# EAGLE design goduino3-v0.22 (EAGLE 6.2)
Design: GOduino 3 Remixed by: Hazim Bitar (techbitar) Date: August 2012 URL: facebook.com/pin13
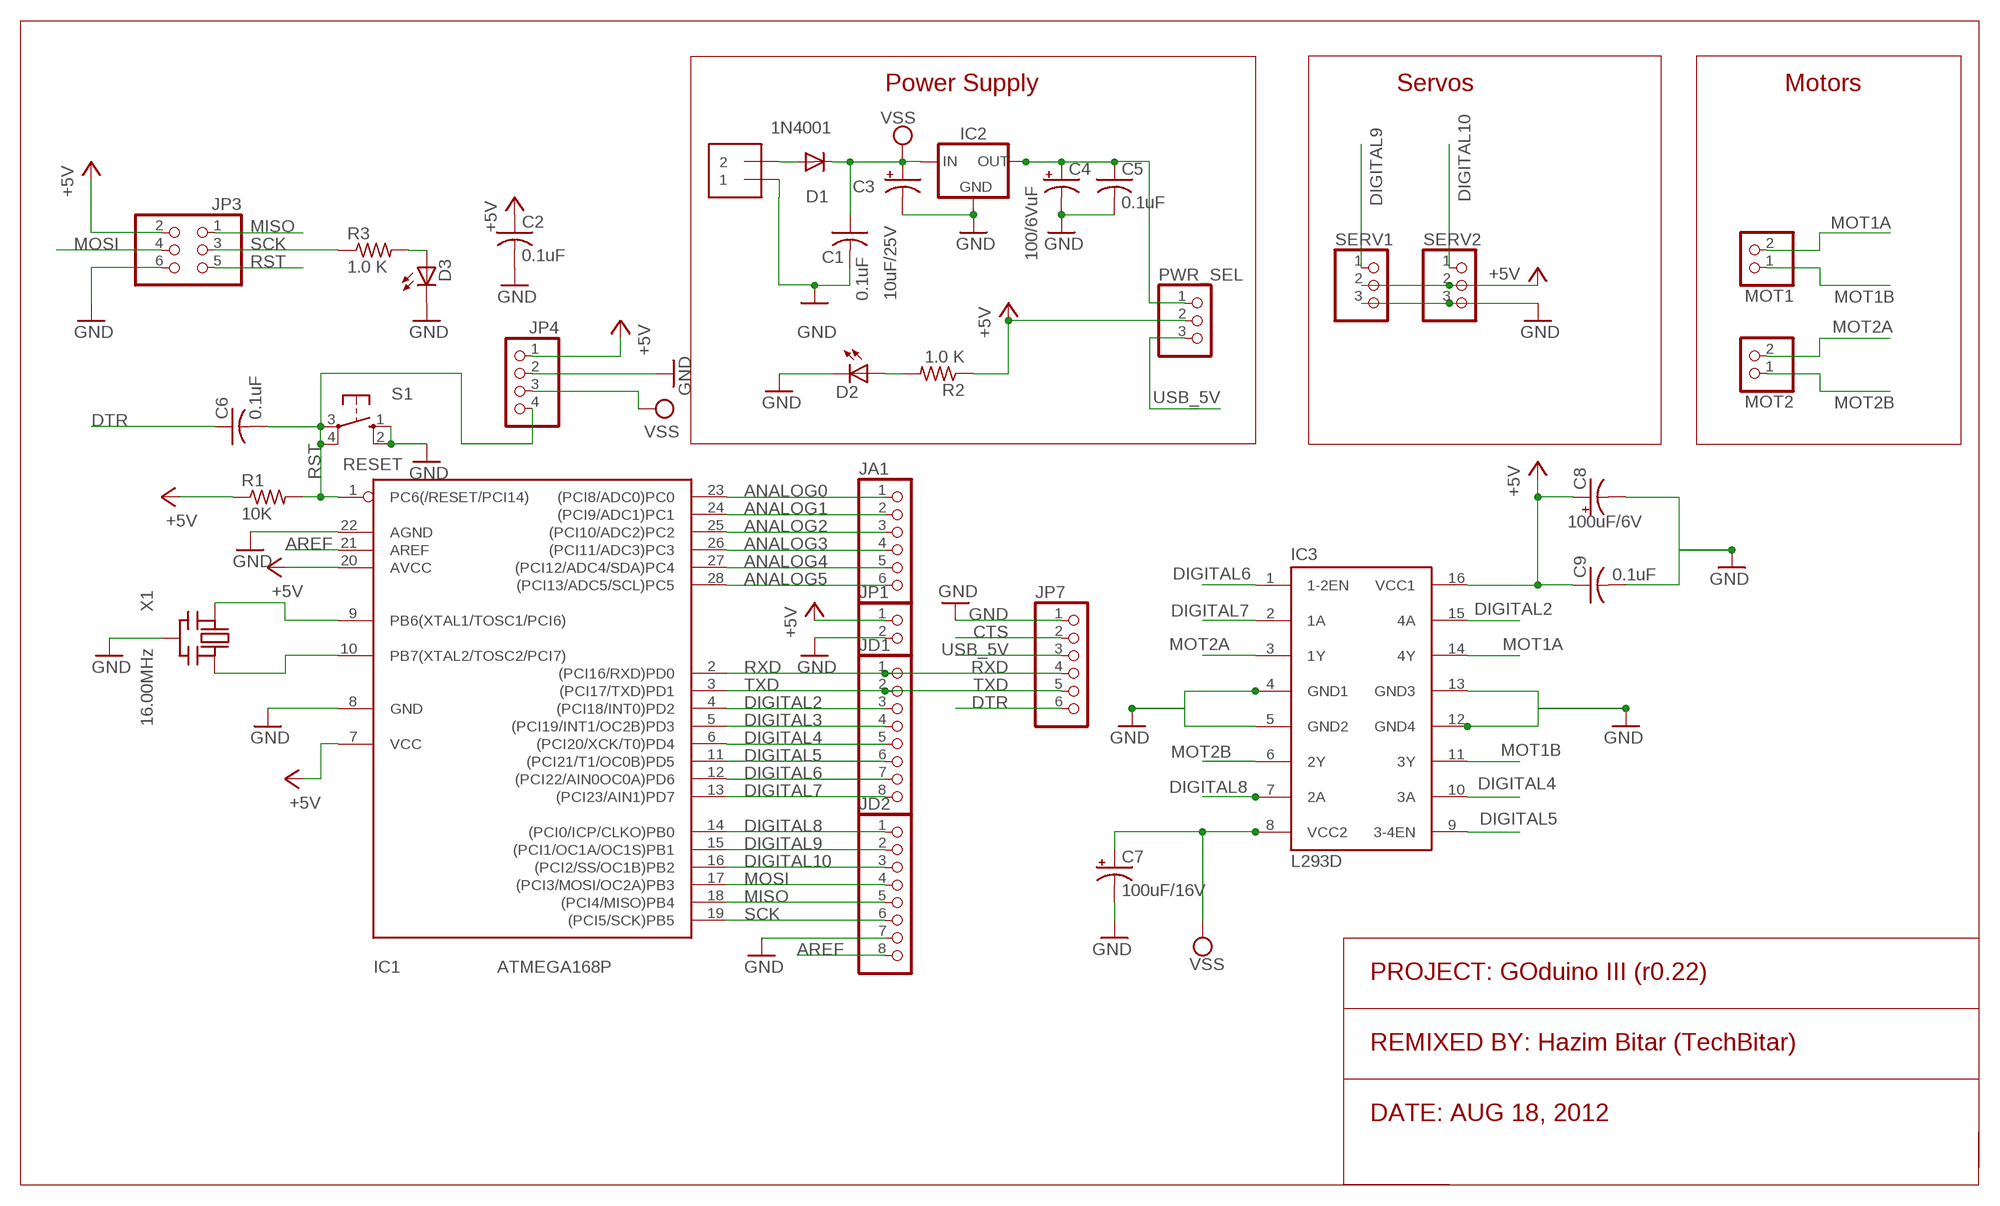
[diagram p0: schematic, sheet 1]

## Parts
C1  0.1uF  C-US025-025X050  [C025-025X050]
C2  0.1uF  C-US025-025X050  [C025-025X050]
C3  10uF/25V  CPOL-USE2.5-6  [E2,5-6]
C4  100/6VuF  CPOL-USE2.5-6  [E2,5-6]
C5  0.1uF  C-US025-025X050  [C025-025X050]
C6  0.1uF  C-US025-025X050  [C025-025X050]
C7  100uF/16V  CPOL-USE2.5-6  [E2,5-6]
C8  100uF/6V  CPOL-USE2.5-5  [E2,5-5]
C9  0.1uF  C-US025-025X050  [C025-025X050]
D1  1N4001  1N4004  [DO41-10]
D2  LED3MM  [LED3MM]
D3  Green  LED3MM  [LED3MM]
IC1  ATMEGA168P  ATMEGA168PROUND  [DIL28/3]
IC2  78XXS  [78XXS]
IC3  L293D  [DIL16]
J2  1X2-3.5MM  [1X2-3.5MM]
JA1  PINHD-1X6CB  [1X06-CLEANBIG]
JD1  PINHD-1X8CLEANBIG  [1X08-CLEANBIG]
JD2  PINHD-1X8CLEANBIG  [1X08-CLEANBIG]
JP1  PINHD-1X2CB  [1X02-CB]
JP3  PINHD-2X3  [2X03]
JP4  PINHD-1X4CB  [1X04-CB]
JP7  PINHD-1X6CLEAN  [1X06-CLEAN]
MOT1  PINHD-1X2CB  [1X02-CB]
MOT2  PINHD-1X2CB  [1X02-CB]
PWR_SEL  PINHD-1X3  [1X03]
R1  10K  R-US_0207/5V  [0207/5V]
R2  1.0 K  R-US_0207/5V  [0207/5V]
R3  1.0 K  R-US_0207/5V  [0207/5V]
S1  RESET  10-XX  [B3F-10XX]
SERV1  PINHD-1X3  [1X03]
SERV2  PINHD-1X3  [1X03]
X1  16.00MHz  CERMOSCILL  [CERM_OSC]

## Nets
+5V [power]: C2.1 C8.+ C9.1 IC1.7(VCC) IC1.20(AVCC) IC3.16(VCC1) JP1.1 JP3.2 JP4.1 PWR_SEL.2 R1.1 R2.1 SERV1.2 SERV2.2
ANALOG0: IC1.23((PCI8/ADC0)PC0) JA1.1
ANALOG1: IC1.24((PCI9/ADC1)PC1) JA1.2
ANALOG2: IC1.25((PCI10/ADC2)PC2) JA1.3
ANALOG3: IC1.26((PCI11/ADC3)PC3) JA1.4
ANALOG4: IC1.27((PCI12/ADC4/SDA)PC4) JA1.5
ANALOG5: IC1.28((PCI13/ADC5/SCL)PC5) JA1.6
AREF: IC1.21(AREF) JD2.8
CTS: JP7.2
DIGITAL2: IC1.4((PCI18/INT0)PD2) IC3.15(4A) JD1.3
DIGITAL3: IC1.5((PCI19/INT1/OC2B)PD3) JD1.4
DIGITAL4: IC1.6((PCI20/XCK/T0)PD4) IC3.10(3A) JD1.5
DIGITAL5: IC1.11((PCI21/T1/OC0B)PD5) IC3.9(3-4EN) JD1.6
DIGITAL6: IC1.12((PCI22/AIN0OC0A)PD6) IC3.1(1-2EN) JD1.7
DIGITAL7: IC1.13((PCI23/AIN1)PD7) IC3.2(1A) JD1.8
DIGITAL8: IC1.14((PCI0/ICP/CLKO)PB0) IC3.7(2A) JD2.1
DIGITAL9: IC1.15((PCI1/OC1A/OC1S)PB1) JD2.2 SERV1.1
DIGITAL10: IC1.16((PCI2/SS/OC1B)PB2) JD2.3 SERV2.1
DTR: C6.1 JP7.6
GND [GND]: C1.2 C2.2 C3.- C4.- C5.2 C7.- C8.- C9.2 D2.K(C) D3.K(C) IC1.8(GND) IC1.22(AGND) IC2.GND IC3.4(GND1) IC3.5(GND2) IC3.12(GND4) IC3.13(GND3) J2.1 JD2.7 JP1.2 JP3.6 JP4.2 JP7.1 S1.1(S) S1.2(S1) SERV1.3 SERV2.3 X1.P$2(GND)
MISO: IC1.18((PCI4/MISO)PB4) JD2.5 JP3.1
MOSI: IC1.17((PCI3/MOSI/OC2A)PB3) JD2.4 JP3.4
MOT1A [MOT]: IC3.14(4Y) MOT1.2
MOT1B [MOT]: IC3.11(3Y) MOT1.1
MOT2A [MOT]: IC3.3(1Y) MOT2.2
MOT2B [MOT]: IC3.6(2Y) MOT2.1
N$1: IC1.9(PB6(XTAL1/TOSC1/PCI6)) X1.P$1(IN)
N$2: IC1.10(PB7(XTAL2/TOSC2/PCI7)) X1.P$3(OUT)
N$3: D2.A R2.2
N$4: D3.A R3.2
N$22 [power]: C4.+ C5.1 IC2.OUT PWR_SEL.1
RST: C6.2 IC1.1(PC6(/RESET/PCI14)) JP3.5 JP4.4 R1.2 S1.3(P) S1.4(P1)
RXD: IC1.2((PCI16/RXD)PD0) JD1.1 JP7.4
SCK: IC1.19((PCI5/SCK)PB5) JD2.6 JP3.3 R3.1
TXD: IC1.3((PCI17/TXD)PD1) JD1.2 JP7.5
USB_5V [power]: JP7.3 PWR_SEL.3
VSS [power]: C1.1 C3.+ C7.+ D1.A D1.C IC2.IN IC3.8(VCC2) J2.2 JP4.3

## Notes on the sheet
- Power Supply | Servos | Motors
- PROJECT: GOduino III (r0.22)
- REMIXED BY: Hazim Bitar (TechBitar)
- DATE: AUG 18, 2012

## Library data of the parts
C1 C2 C5 C6 = minimidi:C-US: CAPACITOR, American symbol
C3 C4 = minimidi:CPOL-US: POLARIZED CAPACITOR, American symbol
C7 C8 = rcl:CPOL-US: POLARIZED CAPACITOR, American symbol
C9 = rcl:C-US: CAPACITOR, American symbol
D1 = minimidi:1N4004: DIODE general purpose rectifier, 1 A
D2 D3 = minimidi:LED: LED OSRAM: - CHIPLED LG R971, LG N971, LY N971, LG Q971, LY Q971, LO R971, LY R971 LH N974, LH R974 LS Q976, LO Q976, LY Q976 LO Q996 - Hyper CHIPLED LW Q18S LB Q993, LB Q99A, LB R99A - SideLED LS A670, LO A670, LY A670, LG A670, LP A670 LB A673, LV A673, LT A673, LW A673 LH A674 LY A675 LS A676, LA A676, LO A676, LY A676, LW A676 LS A679, LY A679, LG A679 - Hyper Micro SIDELED® LS Y876, LA Y876, LO Y876, LY Y876 LT Y87S - SmartLED LW L88C, LW L88S LB L89C, LB L89S, LG L890 LS L89K, LO L89K, LY L89K LS L896, LA L896, LO L896, LY L896 - TOPLED LS T670, LO T670, LY T670, LG T670, LP T670 LSG T670, LSP T670, LSY T670, LOP T670, LYG T670 LG T671, LOG T671, LSG T671 LB T673, LV T673, LT T673, LW T673 LH T674 LS T676, LA T676, LO T676, LY T676, LB T676, LH T676, LSB T676, LW T676 LB T67C, LV T67C, LT T67C, LS T67K, LO T67K, LY T67K, LW E67C LS E67B, LA E67B, LO E67B, LY E67B, LB E67C, LV E67C, LT E67C LW T67C LS T679, LY T679, LG T679 LS T770, LO T770, LY T770, LG T770, LP T770 LB T773, LV T773, LT T773, LW T773 LH T774 LS E675, LA E675, LY E675, LS T675 LS T776, LA T776, LO T776, LY T776, LB T776 LHGB T686 LT T68C, LB T68C - Hyper Mini TOPLED® LB M676 - Mini TOPLED Santana® LG M470 LS M47K, LO M47K, LY M47K Source: http://www.osram.convergy.de/
IC1 = avr:ATMEGA168*P: MICROCONTROLLER 16 kBytes FLASH 1 kBytes SRAM 512 Bytes EEPROM USART 8-channel 10 bit ADC
IC2 = v-reg:78XXS: VOLTAGE REGULATOR
IC3 = st-microelectronics:L293D: PUSH-PULL 4 CHANNEL DRIVER; MPN: L293D; OC_FARNELL: 9589619; OC_NEWARK: 56P8249
J2 = adafruit:1X2: 3.5mm Terminal block http://www.ladyada.net/library/pcb/eaglelibrary.html
JA1 JP7 = carduino:PINHD-1X6: PIN HEADER
JD1 JD2 = carduino:PINHD-1X8: PIN HEADER
JP1 MOT1 MOT2 = carduino:PINHD-1X2: PIN HEADER
JP3 = pinhead-ez:PINHD-2X3: PIN HEADER
JP4 = carduino:PINHD-1X4: PIN HEADER
PWR_SEL SERV1 SERV2 = pinhead:PINHD-1X3: PIN HEADER
R1 = rcl-ez:R-US_: RESISTOR, American symbol
R2 R3 = minimidi:R-US_: RESISTOR, American symbol
S1 = switch-omron:10-XX: OMRON SWITCH
X1 = digg:CERMOSCILL

## Net classes
0 default: width 0.305 mm
1 power: width 0.813 mm
2 GND: width 0.813 mm
3 MOT: width 0.813 mm

## Board
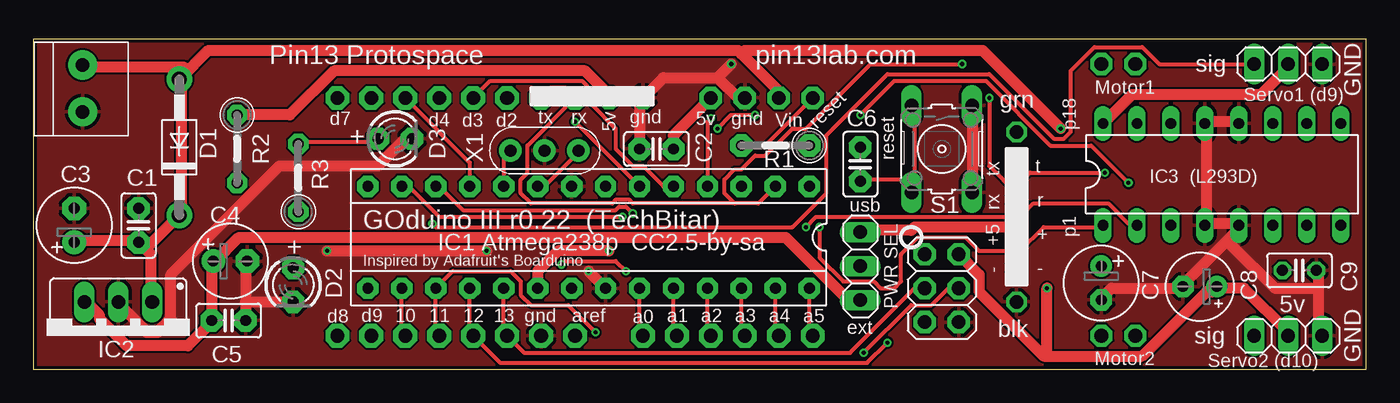
[diagram p1: board, top side]
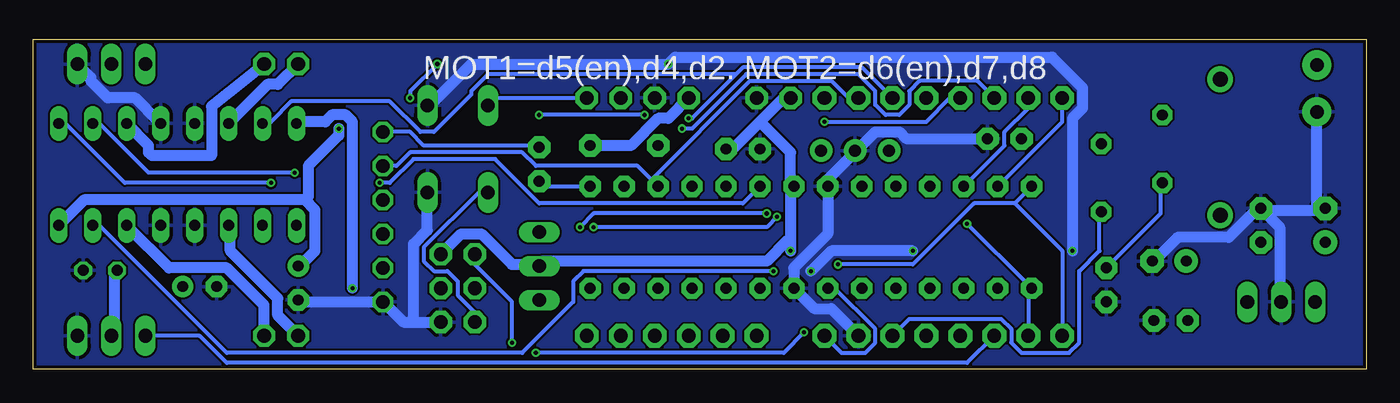
[diagram p2: board, bottom side, seen from below]

Size 99.67 x 24.69 mm. Coordinates in mm from the lower left corner, seen from the top.
Outline: 0,0 99.67,0 99.67,24.69 0,24.69 0,0
Copper layers (1*16): Top 0.035mm / dielectric 1.5mm / Bottom 0.035mm
Design rules: minimum track width 6mil, minimum drill 12mil, track to track 6mil, track to pad 6mil, pad to pad 6mil, via to via 6mil, smd to smd 0mil, copper to edge 10mil, drill to drill 10mil, minimum pad ring 10mil, minimum via ring 6mil, stop-mask expansion 2mil, vias tented up to drill 100mil, thermal gap 10mil

### Footprints (pad centres in the part's own frame; a part is rotated, then mirrored left to right if it is on the bottom)
C025-025X050 = drill 0.813 pad 1.676 octagon: 1 -1.27,0; 2 1.27,0
E2,5-6 = drill 0.813 pad 1.778: + -1.27,0 | drill 0.813 pad 1.778 octagon: - 1.27,0
E2,5-6' = drill 0.813 pad 1.6: + -1.27,0 | drill 0.813 pad 1.6 octagon: - 1.27,0
E2,5-5 = drill 0.813 pad 1.6: + -1.27,0 | drill 0.813 pad 1.6 octagon: - 1.27,0
C025-025X050' = drill 0.813 octagon: 1 -1.27,0; 2 1.27,0
DO41-10 = drill 1.118 pad 1.93: A 5.08,0; C -5.08,0
LED3MM = drill 0.813 pad 1.676 octagon: A -1.27,0; K 1.27,0
DIL28/3 = drill 0.813 pad 1.6 octagon: 1 -16.51,-3.81; 2 -13.97,-3.81; 3 -11.43,-3.81; 4 -8.89,-3.81; 5 -6.35,-3.81; 6 -3.81,-3.81; 7 -1.27,-3.81; 8 1.27,-3.81; 9 3.81,-3.81; 10 6.35,-3.81; 11 8.89,-3.81; 12 11.43,-3.81; 13 13.97,-3.81; 14 16.51,-3.81; 15 16.51,3.81; 16 13.97,3.81; 17 11.43,3.81; 18 8.89,3.81; 19 6.35,3.81; 20 3.81,3.81; 21 1.27,3.81; 22 -1.27,3.81; 23 -3.81,3.81; 24 -6.35,3.81; 25 -8.89,3.81; 26 -11.43,3.81; 27 -13.97,3.81; 28 -16.51,3.81
78XXS = drill 1.016 long: GND 0,-2.54; IN -2.54,-2.54; OUT 2.54,-2.54
DIL16 = drill 0.813 long: 1 -8.89,-3.81; 2 -6.35,-3.81; 3 -3.81,-3.81; 4 -1.27,-3.81; 5 1.27,-3.81; 6 3.81,-3.81; 7 6.35,-3.81; 8 8.89,-3.81; 9 8.89,3.81; 10 6.35,3.81; 11 3.81,3.81; 12 1.27,3.81; 13 -1.27,3.81; 14 -3.81,3.81; 15 -6.35,3.81; 16 -8.89,3.81
1X2-3.5MM = drill 1 pad 2.184: 1 1.8,0; 2 -1.7,0
1X06-CLEANBIG = drill 1.016 pad 1.778 octagon: 1 -6.35,0; 2 -3.81,0; 3 -1.27,0; 4 1.27,0; 5 3.81,0; 6 6.35,0
1X08-CLEANBIG = drill 1.016 pad 1.778 octagon: 1 -8.89,0; 2 -6.35,0; 3 -3.81,0; 4 -1.27,0; 5 1.27,0; 6 3.81,0; 7 6.35,0; 8 8.89,0
1X02-CB = drill 1.016 pad 1.676 octagon: 1 -1.27,0; 2 1.27,0
2X03 = drill 1.016 pad 1.676 octagon: 1 -2.54,-1.27; 2 -2.54,1.27; 3 0,-1.27; 4 0,1.27; 5 2.54,-1.27; 6 2.54,1.27
1X04-CB = drill 1.016 pad 1.676 octagon: 1 -3.81,0; 2 -1.27,0; 3 1.27,0; 4 3.81,0
1X06-CLEAN = drill 1.016 octagon: 1 -6.35,0; 2 -3.81,0; 3 -1.27,0; 4 1.27,0; 5 3.81,0; 6 6.35,0
1X03 = drill 1.016 long: 1 -2.54,0; 2 0,0; 3 2.54,0
0207/5V = drill 0.813 pad 1.676 octagon: 1 -2.54,0; 2 2.54,0
0207/5V' = drill 0.813 pad 1.524 octagon: 1 -2.54,0; 2 2.54,0
B3F-10XX = drill 1.016 long: 1 -3.251,2.261; 2 3.251,2.261; 3 -3.251,-2.261; 4 3.251,-2.261
CERM_OSC = drill 0.9 pad 1.676: P$1 -2.54,0; P$2 0,0; P$3 2.54,0

### Placement (x,y rotation side)
C1  7.87,10.76 90 top
C2  46.6,16.47 180 top
C3  3.04,10.76 90 top
C4  14.73,8.09 0 top
C5  14.6,3.65 0 top
C6  61.84,15.33 270 top
C7  100uF/16V  [E2,5-6']  79.86,6.45 270 top
C8  87.24,6.18 180 top
C9  0.1uF  [C025-025X050']  94.69,7.39 0 top
D1  10.92,16.6 90 top
D2  19.43,6.31 270 top
D3  27.05,17.23 0 top
IC1  41.52,9.87 180 top
IC2  6.35,2.5 180 top
IC3  88.89,14.57 0 top
J2  3.68,21.04 270 top
JA1  51.94,2.5 0 top
JD1  31.62,20.28 180 top
JD2  31.62,2.5 0 top
JP1  44.32,20.28 0 top
JP3  67.94,6.06 270 top
JP4  54.48,20.28 0 top
JP7  73.53,11.39 90 top
MOT1  81.15,22.82 180 top
MOT2  81.15,2.5 180 top
PWR_SEL  61.84,7.71 90 top
R1  55.49,16.73 180 top
R2  1.0 K  [0207/5V']  15.24,16.47 270 top
R3  1.0 K  [0207/5V']  19.81,14.31 90 top
S1  67.94,16.47 270 top
SERV1  93.85,22.82 0 top
SERV2  93.85,2.5 0 top
X1  38.22,16.34 180 top

### Tracks (layer width: path | path; a pad name or v marks a point on that pad's centre or on a via)
+5V  (via drill 0.3)
  Top 0.813: C2.1 47.87,17.49 JP4.1 | JP1.1 43.05,20.54 41.27,22.31 22.47,22.31 19.17,19.01 15.36,19.01 R2.1 | SERV1.2 93.85,22.57 91.82,20.54 82.16,20.54 80.13,18.5 IC3.16 | SERV2.2 93.85,2.76 90.55,6.06 88.51,6.06 C8.+ 88.26,5.8 87.75,5.8 82.93,0.98 75.81,0.98 | IC1.20 37.71,7.33 39.24,8.85 v43.05,8.85 | 75.81,0.98 75.56,0.98 70.73,5.8 70.73,7.07 JP3.2 | v75.81,6.06 75.81,1.23 75.81,0.98
  Bottom 0.813: R1.1 54.99,16.73 52.95,18.76 52.19,18.76 JP4.1 | C2.1 47.37,16.47 45.33,18.5 | 45.33,18.5 43.56,20.28 JP1.1 | SERV2.2 93.59,2.76 93.59,7.33 C9.1 | JP3.2 67.69,10.12 66.16,10.12 63.88,7.84 61.84,7.84 PWR_SEL.2 61.59,8.09 44.83,8.09 43.3,9.61 43.05,9.61 | 43.05,9.61 43.05,13.42 IC1.7 43.05,13.93 43.05,16.22 45.08,18.25 45.33,18.5 | 43.05,9.61 v43.05,8.85 | v75.81,6.06 75.81,18.5 76.32,19.01 77.34,19.01 77.85,18.5 79.88,18.5 IC3.16
ANALOG0
  Top 0.305: IC1.23 45.33,2.76 JA1.1
ANALOG1
  Top 0.305: IC1.24 47.87,2.76 JA1.2
ANALOG2
  Top 0.305: IC1.25 50.41,2.76 JA1.3
ANALOG3
  Top 0.305: IC1.26 52.95,2.76 JA1.4
ANALOG4
  Top 0.305: IC1.27 55.49,2.76 JA1.5
ANALOG5
  Top 0.305: IC1.28 58.03,2.76 JA1.6
AREF
  Bottom 0.305: IC1.21 39.75,6.06 36.7,3.01 36.7,1.99 37.46,1.23 39.24,1.23 JD2.8
DIGITAL2  (via drill 0.3)
  Top 0.305: IC1.4 50.41,18.5 v50.67,18.76
  Bottom 0.305: 47.11,22.06 65.65,22.06 66.92,20.79 66.92,20.54 69.72,17.74 70.73,17.74 73.02,20.03 80.39,20.03 81.91,18.5 82.42,18.5 IC3.15 | 47.11,22.06 46.6,22.57 37.71,22.57 JD1.3 | v50.67,18.76 50.41,18.76 47.11,22.06
DIGITAL3
  Top 0.305: IC1.5 47.11,13.68 45.59,15.2 44.83,15.2 43.56,16.47 43.56,18 41.78,19.77 41.78,20.79 41.02,21.55 34.16,21.55 JD1.4
DIGITAL4  (via drill 0.3)
  Top 0.305: v80.13,14.69 74.54,14.69 v73.78,13.93 | IC1.6 v40.51,18.5
  Bottom 0.305: v80.13,14.69 91.05,14.69 94.61,18.25 95.12,18.25 IC3.10 | v73.78,13.93 73.02,13.93 71.24,15.71 65.15,15.71 61.84,12.41 46.6,12.41 IC1.6 | JD1.5 31.11,20.28 32.89,18.5 v40.51,18.5
DIGITAL5  (via drill 0.3)
  Top 0.305: v81.91,13.93 79.12,16.73 76.07,16.73 71.24,21.55 64.38,21.55 v61.84,19.01 | v53.97,19.01 52.19,19.01 v51.18,18 | IC1.11 32.63,15.46 JD1.6
  Bottom 0.305: v81.91,13.93 92.83,13.93 97.15,18.25 97.66,18.25 IC3.9 | v53.97,19.01 v61.84,19.01 | v51.18,18 50.41,18 46.35,22.06 37.97,22.06 36.7,20.79 36.7,19.77 35.94,19.01 34.92,19.01 34.16,19.77 34.16,20.79 33.4,21.55 29.08,21.55 JD1.6
DIGITAL6  (via drill 0.3)
  Top 0.305: v58.8,10.63 58.8,8.34 60.57,6.57 62.86,6.57 63.37,6.06 64.38,6.06 64.89,6.57 64.89,8.6 66.16,9.87 69.72,9.87 70.73,8.85 73.78,8.85 75.56,10.63 79.88,10.63 IC3.1 | v44.83,11.65 44.32,12.15 43.81,12.15 43.56,11.9 32.13,11.9 30.35,13.68 IC1.12
  Bottom 0.305: v58.8,10.63 57.78,11.65 v44.83,11.65 | JD1.7 25.27,19.52 27.05,17.74 27.05,16.73 IC1.12
DIGITAL7  (via drill 0.3)
  Top 0.305: v57.78,10.63 58.54,11.39 73.78,11.39 74.8,12.41 80.39,12.41 81.91,10.88 82.42,10.88 IC3.2 | v44.06,11.39 30.35,11.39 28.06,13.68 IC1.13
  Bottom 0.305: v57.78,10.63 44.83,10.63 v44.06,11.39 | JD1.8 22.73,18.5 IC1.13
DIGITAL8  (via drill 0.3)
  Top 0.305: v44.32,7.33 43.56,8.09 39.75,8.09 v39.49,7.84
  Bottom 0.305: v44.32,7.33 58.54,7.33 59.3,6.57 59.3,5.04 63.11,1.23 85.21,1.23 94.61,10.63 95.12,10.63 IC3.7 | v39.49,7.84 33.9,7.84 29.33,12.41 26.28,12.41 | IC1.14 26.28,12.41 | JD2.1 22.73,8.85 26.28,12.41
DIGITAL9  (via drill 0.3)
  Top 0.305: SERV1.1 84.2,22.82 82.93,24.09 79.37,24.09 77.59,22.31 77.59,17.74 77.08,17.23 76.32,17.23 71.5,22.06 63.88,22.06 59.3,17.49 59.3,13.17 56.76,10.63 30.09,10.63 v29.84,10.88
  Bottom 0.305: 25.27,6.31 IC1.15 25.27,6.31 | 25.27,6.31 v29.84,10.88 | 25.27,6.31 JD2.2
DIGITAL10
  Top 0.305: IC1.16 27.55,2.76 JD2.3
  Bottom 0.305: SERV2.1 87.24,2.5 85.21,0.47 29.84,0.47 JD2.3
DTR
  Bottom 0.305: JP7.6 71.5,17.74 70.48,16.73 61.84,16.73 C6.1
GND  (via drill 0.3)
  Top 0.813: 15.87,5.04 15.87,8.09 C4.- | 15.87,5.04 15.87,3.77 C5.2 | D2.K 16.12,5.04 15.87,5.04 | D3.K 27.81,17.23 25.78,15.2 18.41,15.2 10.28,7.07 10.28,3.77 9.27,2.76 8.5,2.76 6.22,5.04 IC2.GND | IC3.12 90.04,18.5 87.75,18.5 IC3.13 87.75,18 87.75,11.14 IC3.4 87.75,10.88 90.04,10.88 IC3.5 90.04,10.38 89.28,9.61 | 96.13,6.06 96.13,2.76 SERV2.3 | 96.13,6.06 96.13,7.33 C9.2 | 89.28,9.61 85.97,6.31 C8.- 85.72,6.06 80.64,6.06 79.88,5.3 C7.- | 96.13,6.06 95.88,6.06 92.83,6.06 89.53,9.36 89.28,9.61 | C2.2 45.33,20.03 JP1.2 45.84,20.54 47.11,21.81 51.18,21.81 | JP4.2 52.7,20.28 51.18,21.81 | S1.2 70.23,13.42 70.23,19.52 S1.1 | v52.19,22.82 51.43,22.06 51.18,21.81 | v41.52,7.33 IC1.22 | v21.97,8.85 v33.9,8.85
  Bottom 0.813: D3.K 34.41,17.23 34.92,17.74 36.7,17.74 37.97,16.47 X1.P$2 38.22,16.22 40.51,13.93 IC1.8 40.25,10.12 42.79,7.58 IC1.22 42.54,5.8 41.27,4.53 40,4.53 JD2.7 | IC2.GND 6.47,5.04 6.47,10.63 7.74,11.9 C1.2 | C1.2 7.23,11.9 3.17,11.9 C3.- 3.68,12.15 3.68,19.01 J2.1 | C4.- 15.87,8.09 14.09,9.87 10.28,9.87 8.25,11.9 C1.2 | SERV1.3 95.37,21.81 95.37,21.55 94.1,20.28 92.07,20.28 90.29,18.5 IC3.12 | C7.- 79.62,5.04 JP7.1 73.27,4.79 72,3.52 71.24,3.52 | 71.24,3.52 JP3.6 | S1.2 70.23,13.17 70.23,10.38 71.24,9.36 71.24,3.77 71.24,3.52 | S1.1 69.97,19.77 66.92,22.82 v52.19,22.82 51.94,23.08 51.68,23.33 23.49,23.33 21.2,21.04 21.2,19.52 21.97,18.76 v21.97,8.85 | v41.52,7.33 40,8.85 v33.9,8.85
  pour Top: -0.64,25.23 100.58,25.23 100.58,-1.05 -0.64,-1.05
  pour Bottom: -0.89,25.62 100.96,25.62 100.96,-1.94 -0.89,-1.94
MISO  (via drill 0.3)
  Top 0.305: IC1.18 32.63,2.76 JD2.5 34.92,0.47 62.35,0.47 v63.88,1.99
  Bottom 0.305: JP3.1 66.67,7.84 63.88,5.04 v63.88,1.99
MOSI  (via drill 0.3)
  Top 0.305: JD2.4 30.09,2.76 IC1.17 31.36,7.33 35.68,7.33 36.44,6.57 36.44,5.55 37.21,4.79 40,4.79 v42.03,2.76 | JP3.4 68.45,6.06 67.18,4.79 65.65,4.79 v62.1,1.23
  Bottom 0.305: v62.1,1.23 43.56,1.23 v42.03,2.76
MOT1A
  Bottom 0.813: MOT1.2 81.4,21.3 82.16,21.3 84.96,18.5 IC3.14
MOT1B
  Bottom 0.813: MOT1.1 83.81,21.68 86.35,19.65 86.35,15.96 90.8,15.96 91.05,16.22 91.05,16.73 IC3.11
MOT2A
  Bottom 0.813: MOT2.2 81.4,4.03 81.4,5.3 84.96,8.85 84.96,10.63 IC3.3
MOT2B
  Bottom 0.813: MOT2.1 82.42,4.79 85.21,7.58 89.53,7.58 92.58,10.63 IC3.6
N$1
  Top 0.305: IC1.9 38.22,13.68 40.76,16.22 X1.P$1
N$2
  Top 0.305: IC1.10 35.17,15.71 35.68,16.22 X1.P$3
N$3
  Bottom 0.305: D2.A 15.36,11.65 15.36,13.93 R2.2
N$4
  Top 0.305: D3.A 25.52,16.98 19.93,16.98 R3.2
N$22
  Top 0.813: IC2.OUT 3.93,5.04 4.95,4.03 4.95,3.77 6.98,1.74 11.55,1.74 13.33,3.52 C5.1 13.33,4.03 13.33,7.84 C4.+ 13.58,8.09 15.36,9.87 56.26,9.87 60.83,5.3 61.84,5.3 PWR_SEL.1
RST
  Top 0.305: R1.2 54.73,16.73 JP4.4 | 65.91,14.19 65.91,19.52 S1.3 | 65.91,14.19 65.91,13.42 S1.4 65.91,14.19 | 65.91,14.19 61.84,14.19 C6.2
  Bottom 0.305: IC1.1 61.59,13.68 61.84,13.93 C6.2 | JP3.5 66.67,4.28 67.94,5.55 67.94,6.57 68.7,7.33 69.72,7.33 70.48,8.09 70.48,9.11 66.42,13.17 65.91,13.17 S1.4 | JP4.4 65.15,20.28 65.65,19.77 S1.3
RXD  (via drill 0.3)
  Top 0.305: JP7.4 73.53,13.17 71.5,15.2 v71.5,20.28 | v69.46,22.82 62.61,22.82 57.78,18 56.76,18 54.73,15.96 53.97,15.96 52.95,14.95 52.45,14.95 51.68,14.19 51.68,13.17 52.45,12.41 | 52.45,12.41 54.22,12.41 IC1.2 | JD1.1 36.95,16.73 36.95,14.69 36.44,14.19 36.44,13.17 37.21,12.41 43.3,12.41 43.56,12.66 44.57,12.66 44.83,12.41 52.45,12.41
  Bottom 0.305: v71.5,20.28 71.5,20.79 v69.46,22.82
SCK
  Top 0.305: IC1.19 35.17,2.76 JD2.6 36.7,1.23 61.08,1.23 65.91,6.06 JP3.3
  Bottom 0.305: JD2.6 34.16,3.77 27.3,3.77 26.54,3.01 26.54,1.99 25.78,1.23 22.22,1.23 21.46,1.99 21.46,7.33 19.93,8.85 19.93,11.65 R3.1
TXD
  Bottom 0.305: JP7.5 72.51,15.2 71.5,16.22 63.11,16.22 62.1,15.2 54.48,15.2 53.46,14.19 | 53.46,14.19 IC1.3 53.46,14.19 | JD1.2 38.73,20.28 40,21.55 46.1,21.55 53.46,14.19
USB_5V
  Top 0.813: JP7.3 73.02,10.63 65.91,10.63 65.65,10.38 61.84,10.38 PWR_SEL.3
VSS  (via drill 0.3)
  Top 0.813: IC2.IN 8.76,5.04 8.76,8.6 8,9.36 C1.1 | C3.+ 3.17,9.61 7.49,9.61 C1.1 | C1.1 8.5,9.11 10.79,11.39 D1.C 11.04,11.9 11.04,21.3 D1.A | JP4.3 55.75,20.79 52.95,23.58 | 52.95,23.58 52.7,23.84 13.08,23.84 11.04,21.81 D1.A | J2.2 3.68,22.57 11.3,22.57 D1.A | v76.83,18 70.99,23.84 53.21,23.84 52.95,23.58
  Bottom 0.813: 79.37,12.66 95.88,12.66 97.66,10.88 IC3.8 | 79.37,12.66 78.61,11.9 78.61,8.85 79.62,7.84 C7.+ | v76.83,18 76.83,17.49 79.12,15.2 79.12,12.92 79.37,12.66

### Text on the board
tPlace: sig | GND | Pin13 Protospace | pin13lab.com | Motor1 | Servo1 (d9) | grn | d7 | d4 | d3 | d2 | tx | rx | 5v | gnd | Vin | C6 | reset | gnd | 5v | C2 | reset | p18 | + | D1 | D3 | C3 | C1 | R2 | X1 | R1 | t | IC3 (L293D) | tx | R3 | usb | C4 | S1 | rx | r | GOduino III r0.22 (TechBitar) | IC1 Atmega238p CC2.5-by-sa | + | p1 | + | +5 | Inspired by Adafruit's Boarduino | C9 | - | - | C7 | C8 | 5v | D2 | PWR SEL | GND | d8 | d9 | 10 | 11 | 12 | 13 | gnd | aref | a1 | a2 | a3 | a4 | a5 | a0 | ext | sig | C5 | blk | IC2 | Motor2 | Servo2 (d10)
bPlace: MOT1=d5(en),d4,d2. MOT2=d6(en),d7,d8